# EAGLE design Prototype (EAGLE 9.1.1)
AUTOR: Autor: Alexander Miller; TITLE: Prototype
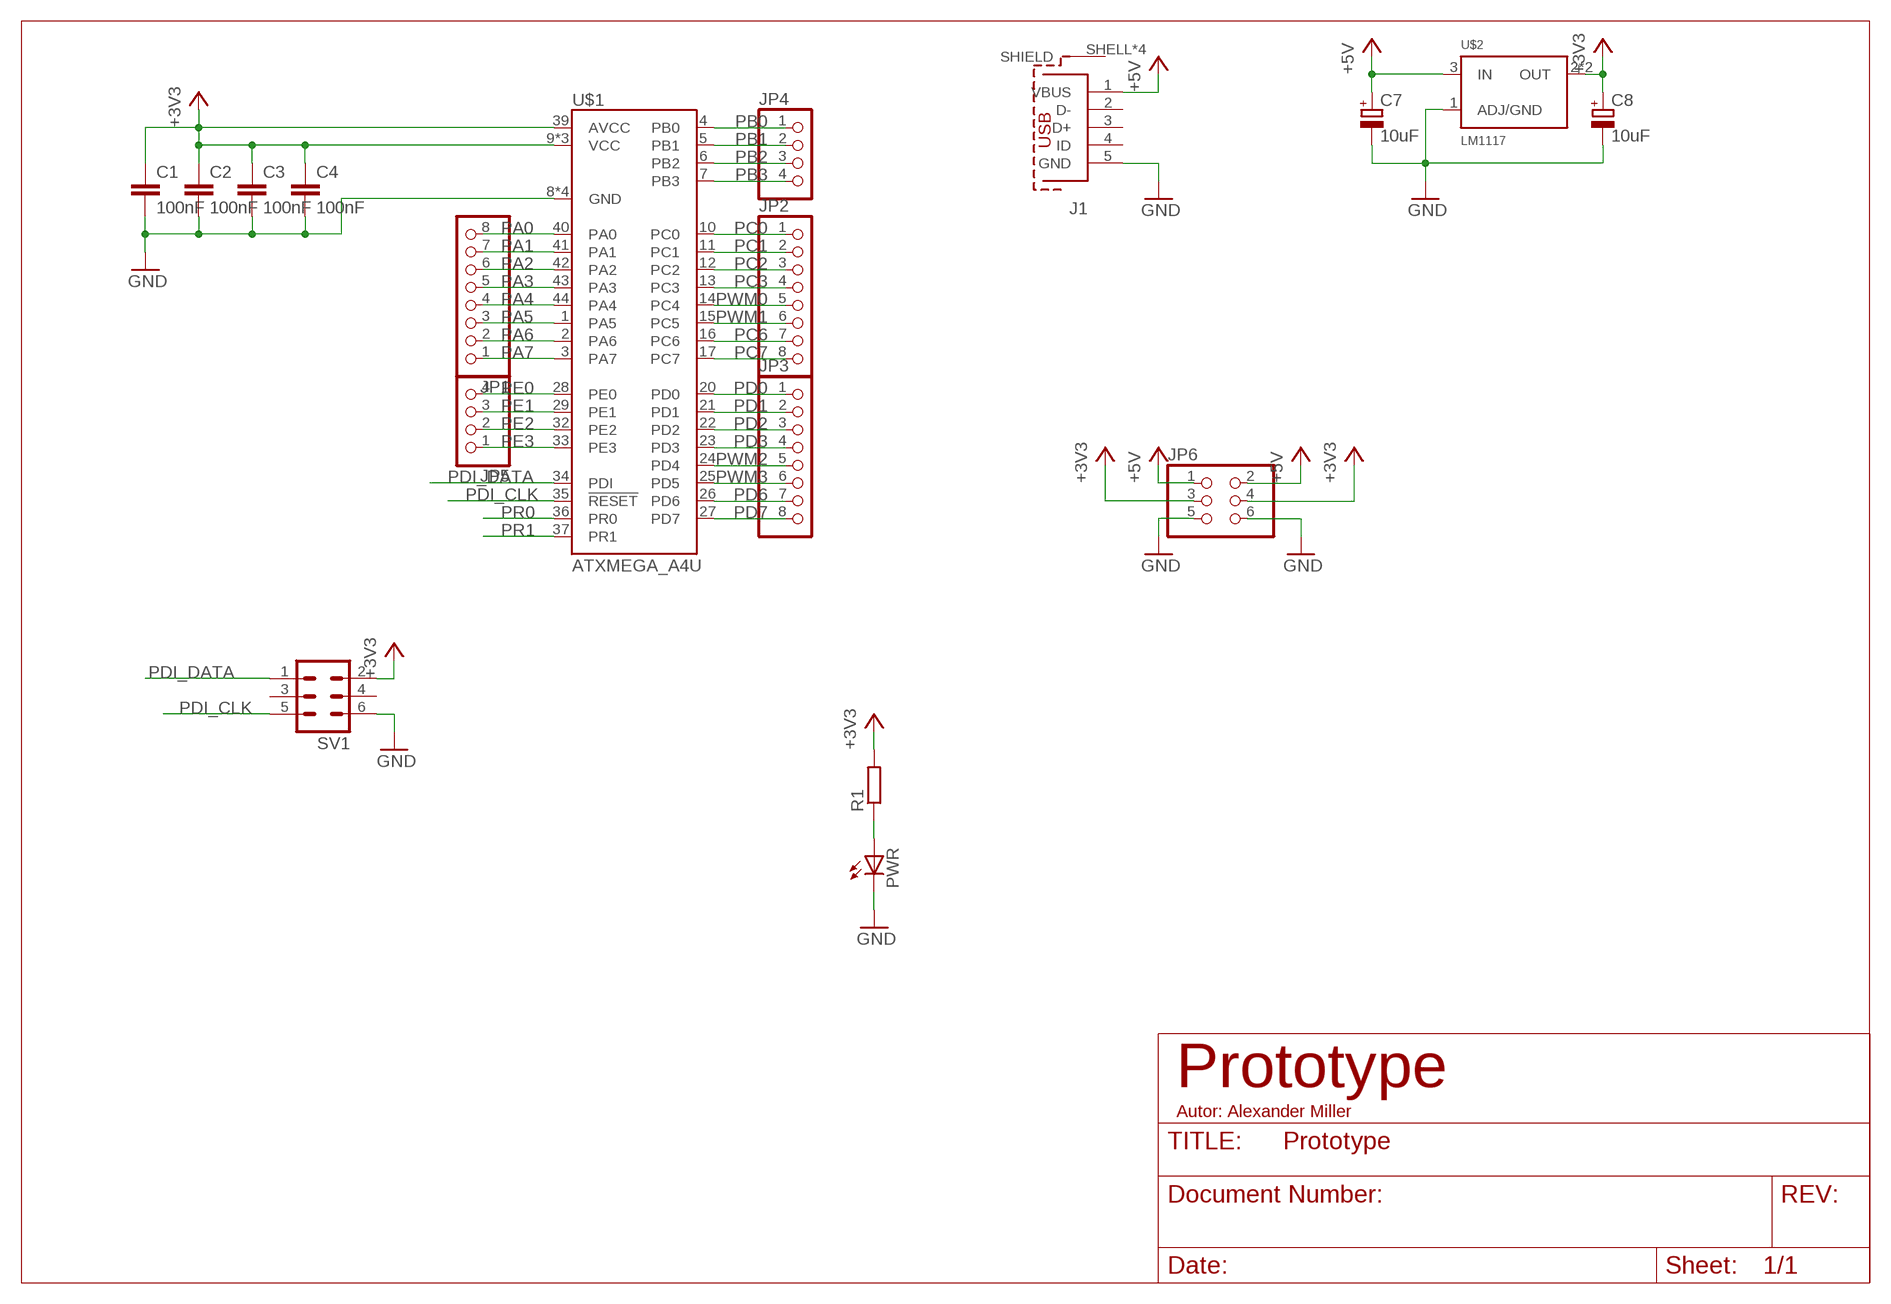
[diagram p0: schematic, sheet 1]

## Parts
C1  100nF  C-EUC0805  [C0805]
C2  100nF  C-EUC0805  [C0805]
C3  100nF  C-EUC0805  [C0805]
C4  100nF  C-EUC0805  [C0805]
C7  10uF  CPOL-EUSMCP  [SMC_P]
C8  10uF  CPOL-EUSMCP  [SMC_P]
J1  629105136821  [629105136821]
JP1  PINHD-1X8  [1X08]
JP2  PINHD-1X8  [1X08]
JP3  PINHD-1X8  [1X08]
JP4  PINHD-1X4  [1X04]
JP5  PINHD-1X4  [1X04]
JP6  PINHD-2X3  [2X03]
PWR  LEDSML0805  [SML0805]
R1  R-EU_R0805  [R0805]
SV1  ML6  [ML6]
U$1  ATXMEGA_A4U  [QFP80P1200X1200X120-44]
U$2  LM1117  [SOT223]

## Nets
+3V3: C1.1 C2.1 C3.1 C4.1 C8.+ JP6.3 JP6.4 R1.2 SV1.2 U$1.9(VCC) U$1.19(VCC) U$1.31(VCC) U$1.39(AVCC) U$2.2(OUT) U$2.4(OUT)
+5V: C7.+ J1.1(VBUS) JP6.1 JP6.2 U$2.3(IN)
GND: C1.2 C2.2 C3.2 C4.2 C7.- C8.- J1.5(GND) JP6.5 JP6.6 PWR.C SV1.6 U$1.8(GND) U$1.18(GND) U$1.30(GND) U$1.38(GND) U$2.1(ADJ/GND)
N$1: PWR.A R1.1
PA0: JP1.8 U$1.40(PA0)
PA1: JP1.7 U$1.41(PA1)
PA2: JP1.6 U$1.42(PA2)
PA3: JP1.5 U$1.43(PA3)
PA4: JP1.4 U$1.44(PA4)
PA5: JP1.3 U$1.1(PA5)
PA6: JP1.2 U$1.2(PA6)
PA7: JP1.1 U$1.3(PA7)
PB0: JP4.1 U$1.4(PB0)
PB1: JP4.2 U$1.5(PB1)
PB2: JP4.3 U$1.6(PB2)
PB3: JP4.4 U$1.7(PB3)
PC0: JP2.1 U$1.10(PC0)
PC1: JP2.2 U$1.11(PC1)
PC2: JP2.3 U$1.12(PC2)
PC3: JP2.4 U$1.13(PC3)
PC6: JP2.7 U$1.16(PC6)
PC7: JP2.8 U$1.17(PC7)
PD0: JP3.1 U$1.20(PD0)
PD1: JP3.2 U$1.21(PD1)
PD2: JP3.3 U$1.22(PD2)
PD3: JP3.4 U$1.23(PD3)
PD6: JP3.7 U$1.26(PD6)
PD7: JP3.8 U$1.27(PD7)
PDI_CLK: SV1.5 U$1.35(!RESET)
PDI_DATA: SV1.1 U$1.34(PDI)
PE0: JP5.4 U$1.28(PE0)
PE1: JP5.3 U$1.29(PE1)
PE2: JP5.2 U$1.32(PE2)
PE3: JP5.1 U$1.33(PE3)
PR0: U$1.36(PR0)
PR1: U$1.37(PR1)
PWM0: JP2.5 U$1.14(PC4)
PWM1: JP2.6 U$1.15(PC5)
PWM2: JP3.5 U$1.24(PD4)
PWM3: JP3.6 U$1.25(PD5)
Unconnected: J1.2(D-) J1.3(D+) J1.4(ID) J1.SHELL1(SHIELD) J1.SHELL2(SHIELD) J1.SHELL3(SHIELD) J1.SHELL(SHIELD) SV1.3 SV1.4

## Library data of the parts
C1-C4 = rcl:C-EU: CAPACITOR, European symbol; SPICEPREFIX: C
C7 C8 = rcl:CPOL-EU: POLARIZED CAPACITOR, European symbol; SPICEPREFIX: C
J1 = InputOutputIO (rev18a):629105136821: WR-COM SMT Horizontal 5 Contacts Micro USB Type B,5 pins=>Code : Con_I-O_COM_MicroUSB_629105136821 <http://katalog.we-online.de/media/images/eican/Con_I-O_COM_MicroUSB_629105136821_pf2.jpg> Details see: http://katalog.we-online.de/en/em/COM_MICRO_SMT_TYPE_B_HORIZONTAL/629105136821?m Created 2014-07-09, Karrer Zheng 2014 (C) Würth Elektronik
JP1-JP3 = pinhead:PINHD-1X8: PIN HEADER
JP4 JP5 = pinhead:PINHD-1X4: PIN HEADER
JP6 = pinhead:PINHD-2X3: PIN HEADER
PWR = led:LED: LED OSRAM: - CHIPLED LG R971, LG N971, LY N971, LG Q971, LY Q971, LO R971, LY R971 LH N974, LH R974 LS Q976, LO Q976, LY Q976 LO Q996 - Hyper CHIPLED LW Q18S LB Q993, LB Q99A, LB R99A - SideLED LS A670, LO A670, LY A670, LG A670, LP A670 LB A673, LV A673, LT A673, LW A673 LH A674 LY A675 LS A676, LA A676, LO A676, LY A676, LW A676 LS A679, LY A679, LG A679 - Hyper Micro SIDELED® LS Y876, LA Y876, LO Y876, LY Y876 LT Y87S - SmartLED LW L88C, LW L88S LB L89C, LB L89S, LG L890 LS L89K, LO L89K, LY L89K LS L896, LA L896, LO L896, LY L896 - TOPLED LS T670, LO T670, LY T670, LG T670, LP T670 LSG T670, LSP T670, LSY T670, LOP T670, LYG T670 LG T671, LOG T671, LSG T671 LB T673, LV T673, LT T673, LW T673 LH T674 LS T676, LA T676, LO T676, LY T676, LB T676, LH T676, LSB T676, LW T676 LB T67C, LV T67C, LT T67C, LS T67K, LO T67K, LY T67K, LW E67C LS E67B, LA E67B, LO E67B, LY E67B, LB E67C, LV E67C, LT E67C LW T67C LS T679, LY T679, LG T679 LS T770, LO T770, LY T770, LG T770, LP T770 LB T773, LV T773, LT T773, LW T773 LH T774 LS E675, LA E675, LY E675, LS T675 LS T776, LA T776, LO T776, LY T776, LB T776 LHGB T686 LT T68C, LB T68C - Hyper Mini TOPLED® LB M676 - Mini TOPLED Santana® LG M470 LS M47K, LO M47K, LY M47K Source: http://www.osram.convergy.de LUXEON: - LUMILED® LXK2-PW12-R00, LXK2-PW12-S00, LXK2-PW14-U00, LXK2-PW14-V00 LXK2-PM12-R00, LXK2-PM12-S00, LXK2-PM14-U00 LXK2-PE12-Q00, LXK2-PE12-R00, LXK2-PE12-S00, LXK2-PE14-T00, LXK2-PE14-U00 LXK2-PB12-K00, LXK2-PB12-L00, LXK2-PB12-M00, LXK2-PB14-N00, LXK2-PB14-P00, LXK2-PB14-Q00 LXK2-PR12-L00, LXK2-PR12-M00, LXK2-PR14-Q00, LXK2-PR14-R00 LXK2-PD12-Q00, LXK2-PD12-R00, LXK2-PD12-S00 LXK2-PH12-R00, LXK2-PH12-S00 LXK2-PL12-P00, LXK2-PL12-Q00, LXK2-PL12-R00 Source: www.luxeon.com KINGBRIGHT: KA-3528ASYC Source: www.kingbright.com
R1 = rcl:R-EU_: RESISTOR, European symbol; SPICEPREFIX: R
SV1 = con-ml:ML6: HARTING; OC_FARNELL: unknown; OC_NEWARK: unknown
U$1 = HeRo:ATXMEGA_A4U
U$2 = RPI:LM1117

## Board
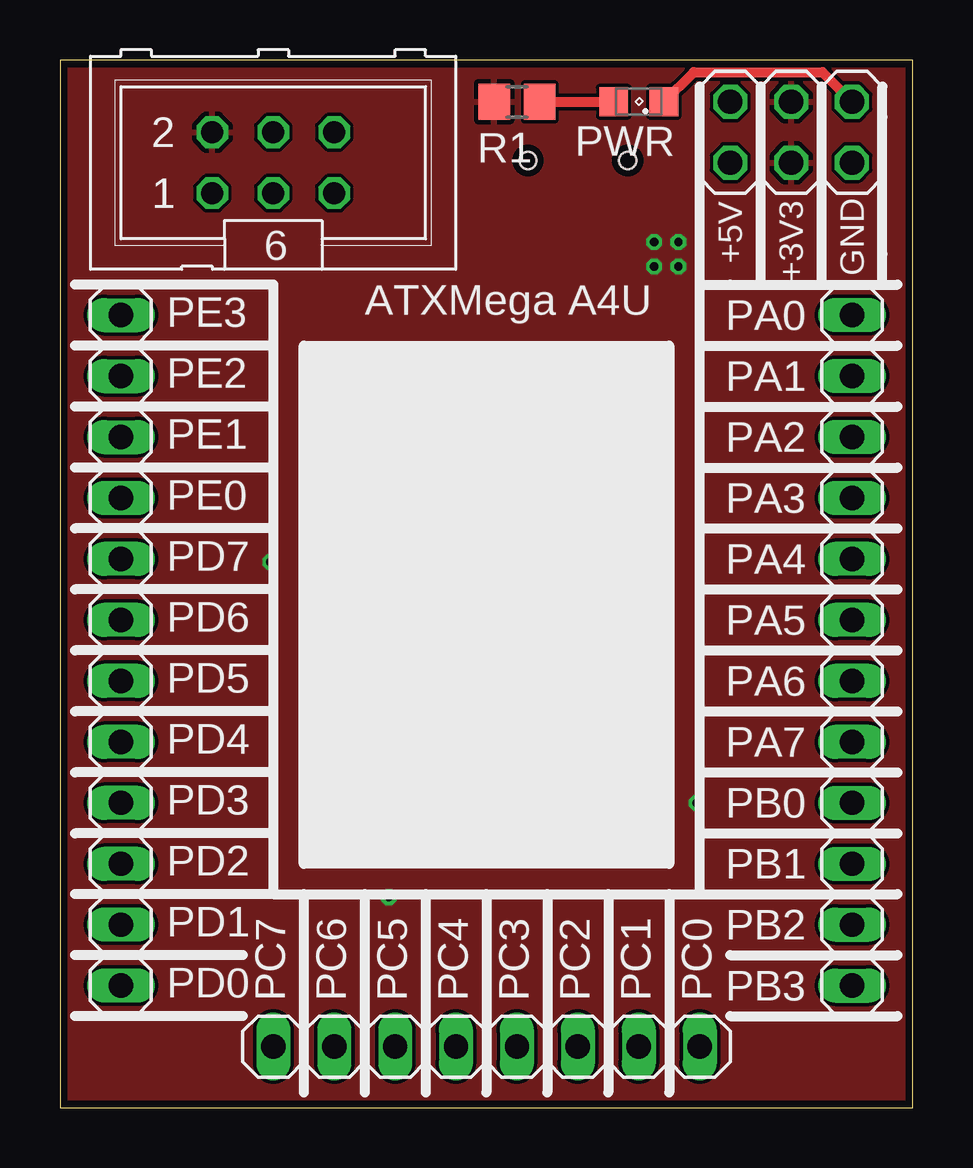
[diagram p1: board, top side]
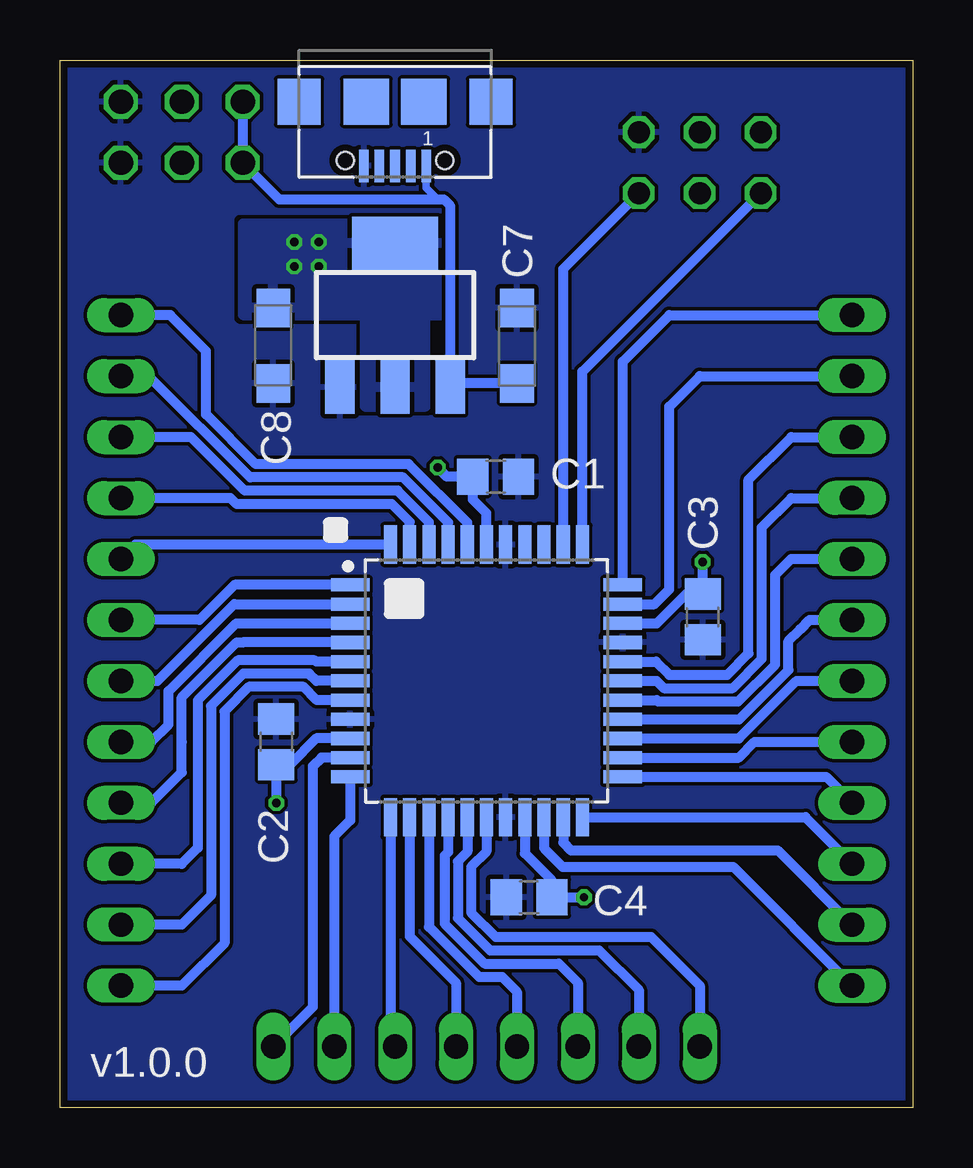
[diagram p2: board, bottom side, seen from below]

Size 35.56 x 43.65 mm. Coordinates in mm from the lower left corner, seen from the top.
Outline: 0,0 35.56,0 35.56,43.65 0,43.65 0,0
Copper layers (1*16): Top 0.035mm / dielectric 1.5mm / Bottom 0.035mm
Design rules "PCB-POOL Standard *": minimum track width 0.15mm, minimum drill 0.3mm, track to track 0.15mm, track to pad 0.15mm, pad to pad 0.15mm, via to via 0.15mm, smd to smd 0.15mm, copper to edge 0.3mm, drill to drill 0.2mm, minimum pad ring 0.2mm, minimum via ring 0.15mm, stop-mask expansion 0.075mm, vias tented up to drill 0mil, thermal gap 0.2mm

### Footprints (pad centres in the part's own frame; a part is rotated, then mirrored left to right if it is on the bottom)
C0805 = smd 1.3 x 1.5: 1 -0.95,0; 2 0.95,0
SMC_P = smd 1.6 x 1.4: + -1.575,0; - 1.575,0
629105136821 = smd 0.4 x 1.35: 1 -1.3,2.675; 2 -0.65,2.675; 3 0,2.675; 4 0.65,2.675; 5 1.3,2.675 | smd 1.8 x 1.9: SHELL -4,0; SHELL3 4,0 | smd 1.9 x 1.9: SHELL1 -1.2,0; SHELL2 1.2,0 | hole 0.7: -2.075,2.45; 2.075,2.45
1X08 = drill 1.016 long: 1 -8.89,0; 2 -6.35,0; 3 -3.81,0; 4 -1.27,0; 5 1.27,0; 6 3.81,0; 7 6.35,0; 8 8.89,0
1X04 = drill 1.016 long: 1 -3.81,0; 2 -1.27,0; 3 1.27,0; 4 3.81,0
2X03 = drill 1.016 octagon: 1 -2.54,-1.27; 2 -2.54,1.27; 3 0,-1.27; 4 0,1.27; 5 2.54,-1.27; 6 2.54,1.27
SML0805 = smd 1.2 x 1.2: A 1.05,0; C -1.05,0
R0805 = smd 1.3 x 1.5: 1 -0.95,0; 2 0.95,0
ML6 = drill 0.914 octagon: 1 -2.54,-1.27; 2 -2.54,1.27; 3 0,-1.27; 4 0,1.27; 5 2.54,-1.27; 6 2.54,1.27
QFP80P1200X1200X120-44 = smd 1.6 x 0.547: 1 -5.681,4; 2 -5.681,3.2; 3 -5.681,2.4; 4 -5.681,1.6; 5 -5.681,0.8; 6 -5.681,0; 7 -5.681,-0.8; 8 -5.681,-1.6; 9 -5.681,-2.4; 10 -5.681,-3.2; 11 -5.681,-4; 23 5.681,-4; 24 5.681,-3.2; 25 5.681,-2.4; 26 5.681,-1.6; 27 5.681,-0.8; 28 5.681,0; 29 5.681,0.8; 30 5.681,1.6; 31 5.681,2.4; 32 5.681,3.2; 33 5.681,4 | smd 0.547 x 1.6: 12 -4,-5.681; 13 -3.2,-5.681; 14 -2.4,-5.681; 15 -1.6,-5.681; 16 -0.8,-5.681; 17 0,-5.681; 18 0.8,-5.681; 19 1.6,-5.681; 20 2.4,-5.681; 21 3.2,-5.681; 22 4,-5.681; 34 4,5.681; 35 3.2,5.681; 36 2.4,5.681; 37 1.6,5.681; 38 0.8,5.681; 39 0,5.681; 40 -0.8,5.681; 41 -1.6,5.681; 42 -2.4,5.681; 43 -3.2,5.681; 44 -4,5.681
SOT223 = smd 1.219 x 2.235: 1 -2.3,-3; 2 0,-3; 3 2.3,-3 | smd 3.6 x 2.2: 4 0,3

### Placement (x,y rotation side)
C1  17.4,26.29 0 bottom
C2  26.54,15.24 90 bottom
C3  8.76,20.45 270 bottom
C4  16,8.76 180 bottom
C7  16.51,31.75 90 bottom
C8  26.67,31.75 270 bottom
J1  21.59,41.91 180 bottom
JP1  33.02,24.13 90 top
JP2  17.78,2.54 180 top
JP3  2.54,13.97 90 top
JP4  33.02,8.89 270 top
JP5  2.54,29.21 270 top
JP6  30.48,40.64 0 top
PWR  24.13,41.91 180 top
R1  19.05,41.91 180 top
SV1  8.89,39.37 0 top
U$1  17.78,17.78 0 bottom
U$2  21.59,33.02 0 bottom

### Tracks (layer width: path | path; a pad name or v marks a point on that pad's centre or on a via)
+3V3  (via drill 0.35)
  Bottom 0.406: U$1.39 17.78,24.77 18.35,25.33 C1.1 19.43,26.29 v19.81,26.67 | U$1.31 10.68,20.18 9.46,21.4 C3.1 v8.76,22.73 | U$1.9 24.88,15.38 25.97,14.29 C2.1 v26.54,12.7 | v13.72,8.76 C4.1 15.05,9.46 16.18,10.59 U$1.19
  other vias: 24.77,36.07 25.78,36.07 24.77,35.05 25.78,35.05
  pour Top: 0,43.65 35.56,43.65 35.56,0 0,0
  pour Bottom: 19.05,36.83 27.94,36.83 27.94,33.02 22.86,33.02 22.86,29.21 20.32,29.21 20.32,33.02 19.05,33.02
+5V
  Bottom 0.305: J1.1 20.29,38.32 20.19,38.23 19.81,37.85
  Bottom 0.406: 19.3,30.03 19.3,37.59 19.56,37.85 19.81,37.85 26.42,37.85 JP6.1 JP6.2 | 19.3,30.03 U$2.3 | C7.+ 19.16,30.18 19.3,30.03
GND
  Top 0.406: PWR.C 26.42,43.15 31.78,43.15 JP6.6
  pour Bottom (rank 6): 0,43.65 35.56,43.65 35.56,0 0,0
N$1
  Top 0.406: R1.1 PWR.A
PA0
  Bottom 0.406: U$1.40 18.58,24.37 21.03,26.82 27.4,26.82 29.47,28.88 29.47,31.52 30.96,33.02 JP1.8
PA1
  Bottom 0.406: U$1.41 19.38,24.38 21.26,26.26 27.63,26.26 31.85,30.48 JP1.7
PA2
  Bottom 0.406: JP1.6 30.1,27.94 27.86,25.7 21.49,25.7 20.18,24.4 U$1.42 | U$1.42
PA3
  Bottom 0.406: U$1.43 20.98,24.41 21.72,25.15 28.19,25.15 28.45,25.4 JP1.5
PA4
  Bottom 0.406: JP1.4 32.42,23.46 U$1.44
PA5
  Bottom 0.406: JP1.3 29.74,20.32 28.28,21.78 U$1.1
PA6
  Bottom 0.406: U$1.2 28.3,20.98 31.5,17.78 JP1.2
PA7
  Bottom 0.406: U$1.3 28.21,20.18 31.04,17.35 31.04,15.95 31.75,15.24 JP1.1
PB0
  Bottom 0.406: U$1.4 27.94,19.38 28.19,19.38 30.48,17.09 30.48,15.24 30.48,13.97 31.75,12.7 JP4.1
PB1
  Bottom 0.406: U$1.5 24.88,18.58 24.94,18.64 28.15,18.64 29.82,16.97 29.82,10.82 30.48,10.16 JP4.2
PB2
  Bottom 0.406: U$1.6 24.87,17.78 25.17,18.08 27.92,18.08 29.26,16.74 29.26,8.84 30.48,7.62 JP4.3
PB3
  Bottom 0.406: U$1.7 24.85,16.98 25.4,17.53 27.69,17.53 28.7,16.51 28.7,6.86 30.48,5.08 JP4.4
PC0
  Bottom 0.406: JP2.1 25.02,4.19 25.02,14.22 24.66,14.58 U$1.10
PC1
  Bottom 0.406: U$1.11 23.46,11.97 24.13,11.3 JP2.2
PC2
  Bottom 0.406: U$1.12 21.78,2.73 JP2.3
PC3
  Bottom 0.406: U$1.13 20.98,7.14 19.05,5.21 JP2.4
PC6
  Bottom 0.406: U$1.16 18.58,10.65 18.97,10.26 18.97,7.9 17.63,6.56 13.08,6.56 11.43,4.91 JP2.7
PC7
  Bottom 0.406: U$1.17 17.78,10.67 18.41,10.03 18.41,8.13 17.4,7.11 10.92,7.11 8.89,5.08 JP2.8
PD0
  Bottom 0.406: U$1.20 15.38,10.81 14.61,10.03 7.49,10.03 JP3.1
PD1
  Bottom 0.406: U$1.21 14.58,11.05 14.25,10.72 5.64,10.72 JP3.2
PD2
  Bottom 0.406: U$1.22 4.48,12.1 JP3.3
PD3
  Bottom 0.406: U$1.23 3.62,13.78 JP3.4
PD6
  Bottom 0.406: U$1.26 7.24,16.18 5.19,18.23 5.19,19.45 4.7,19.94 4.32,20.32 JP3.7
PD7
  Bottom 0.406: U$1.27 10.68,16.98 10.62,16.92 7.29,16.92 5.75,18.46 5.75,22.2 5.08,22.86 JP3.8
PDI_CLK
  Bottom 0.406: SV1.5 14.58,34.95 U$1.35
PDI_DATA
  Bottom 0.406: U$1.34 13.78,30.67 SV1.1
PE0
  Bottom 0.406: U$1.28 10.69,17.78 10.39,17.48 7.52,17.48 6.3,18.69 6.3,24.18 5.08,25.4 JP5.4
PE1
  Bottom 0.406: U$1.29 10.71,18.58 10.16,18.03 7.75,18.03 6.86,18.92 6.86,26.16 5.08,27.94 JP5.3
PE2
  Bottom 0.406: U$1.32 10.77,20.98 10.16,21.59 10.16,29.21 8.89,30.48 JP5.2
PE3
  Bottom 0.406: U$1.33 12.1,31.08 10.16,33.02 JP5.1
PWM0
  Bottom 0.406: U$1.14 20.18,7.53 18.09,5.44 17.13,5.44 16.51,4.83 JP2.5
PWM1
  Bottom 0.406: U$1.15 19.38,10.64 19.53,10.49 19.53,7.67 17.86,6 14.76,6 13.97,5.21 JP2.6
PWM2
  Bottom 0.406: U$1.24 7.27,14.58 6.61,15.24 JP3.5
PWM3
  Bottom 0.406: U$1.25 7.25,15.38 4.85,17.78 JP3.6

### Text on the board
tPlace: +5V | GND | +3V3 | PA0 | PE3 | ATXMega A4U | PA1 | PE2 | PA2 | PE1 | PA3 | PE0 | PA4 | PD7 | PA5 | PD6 | PA6 | PD5 | PA7 | PD4 | PB0 | PD3 | PB1 | PD2 | PB2 | PD1 | PB3 | PD0 | PC7 | PC6 | PC5 | PC4 | PC3 | PC2 | PC1 | PC0
bPlace: v1.0.0